# EAGLE design a915-enhancer (EAGLE 7.6.0)
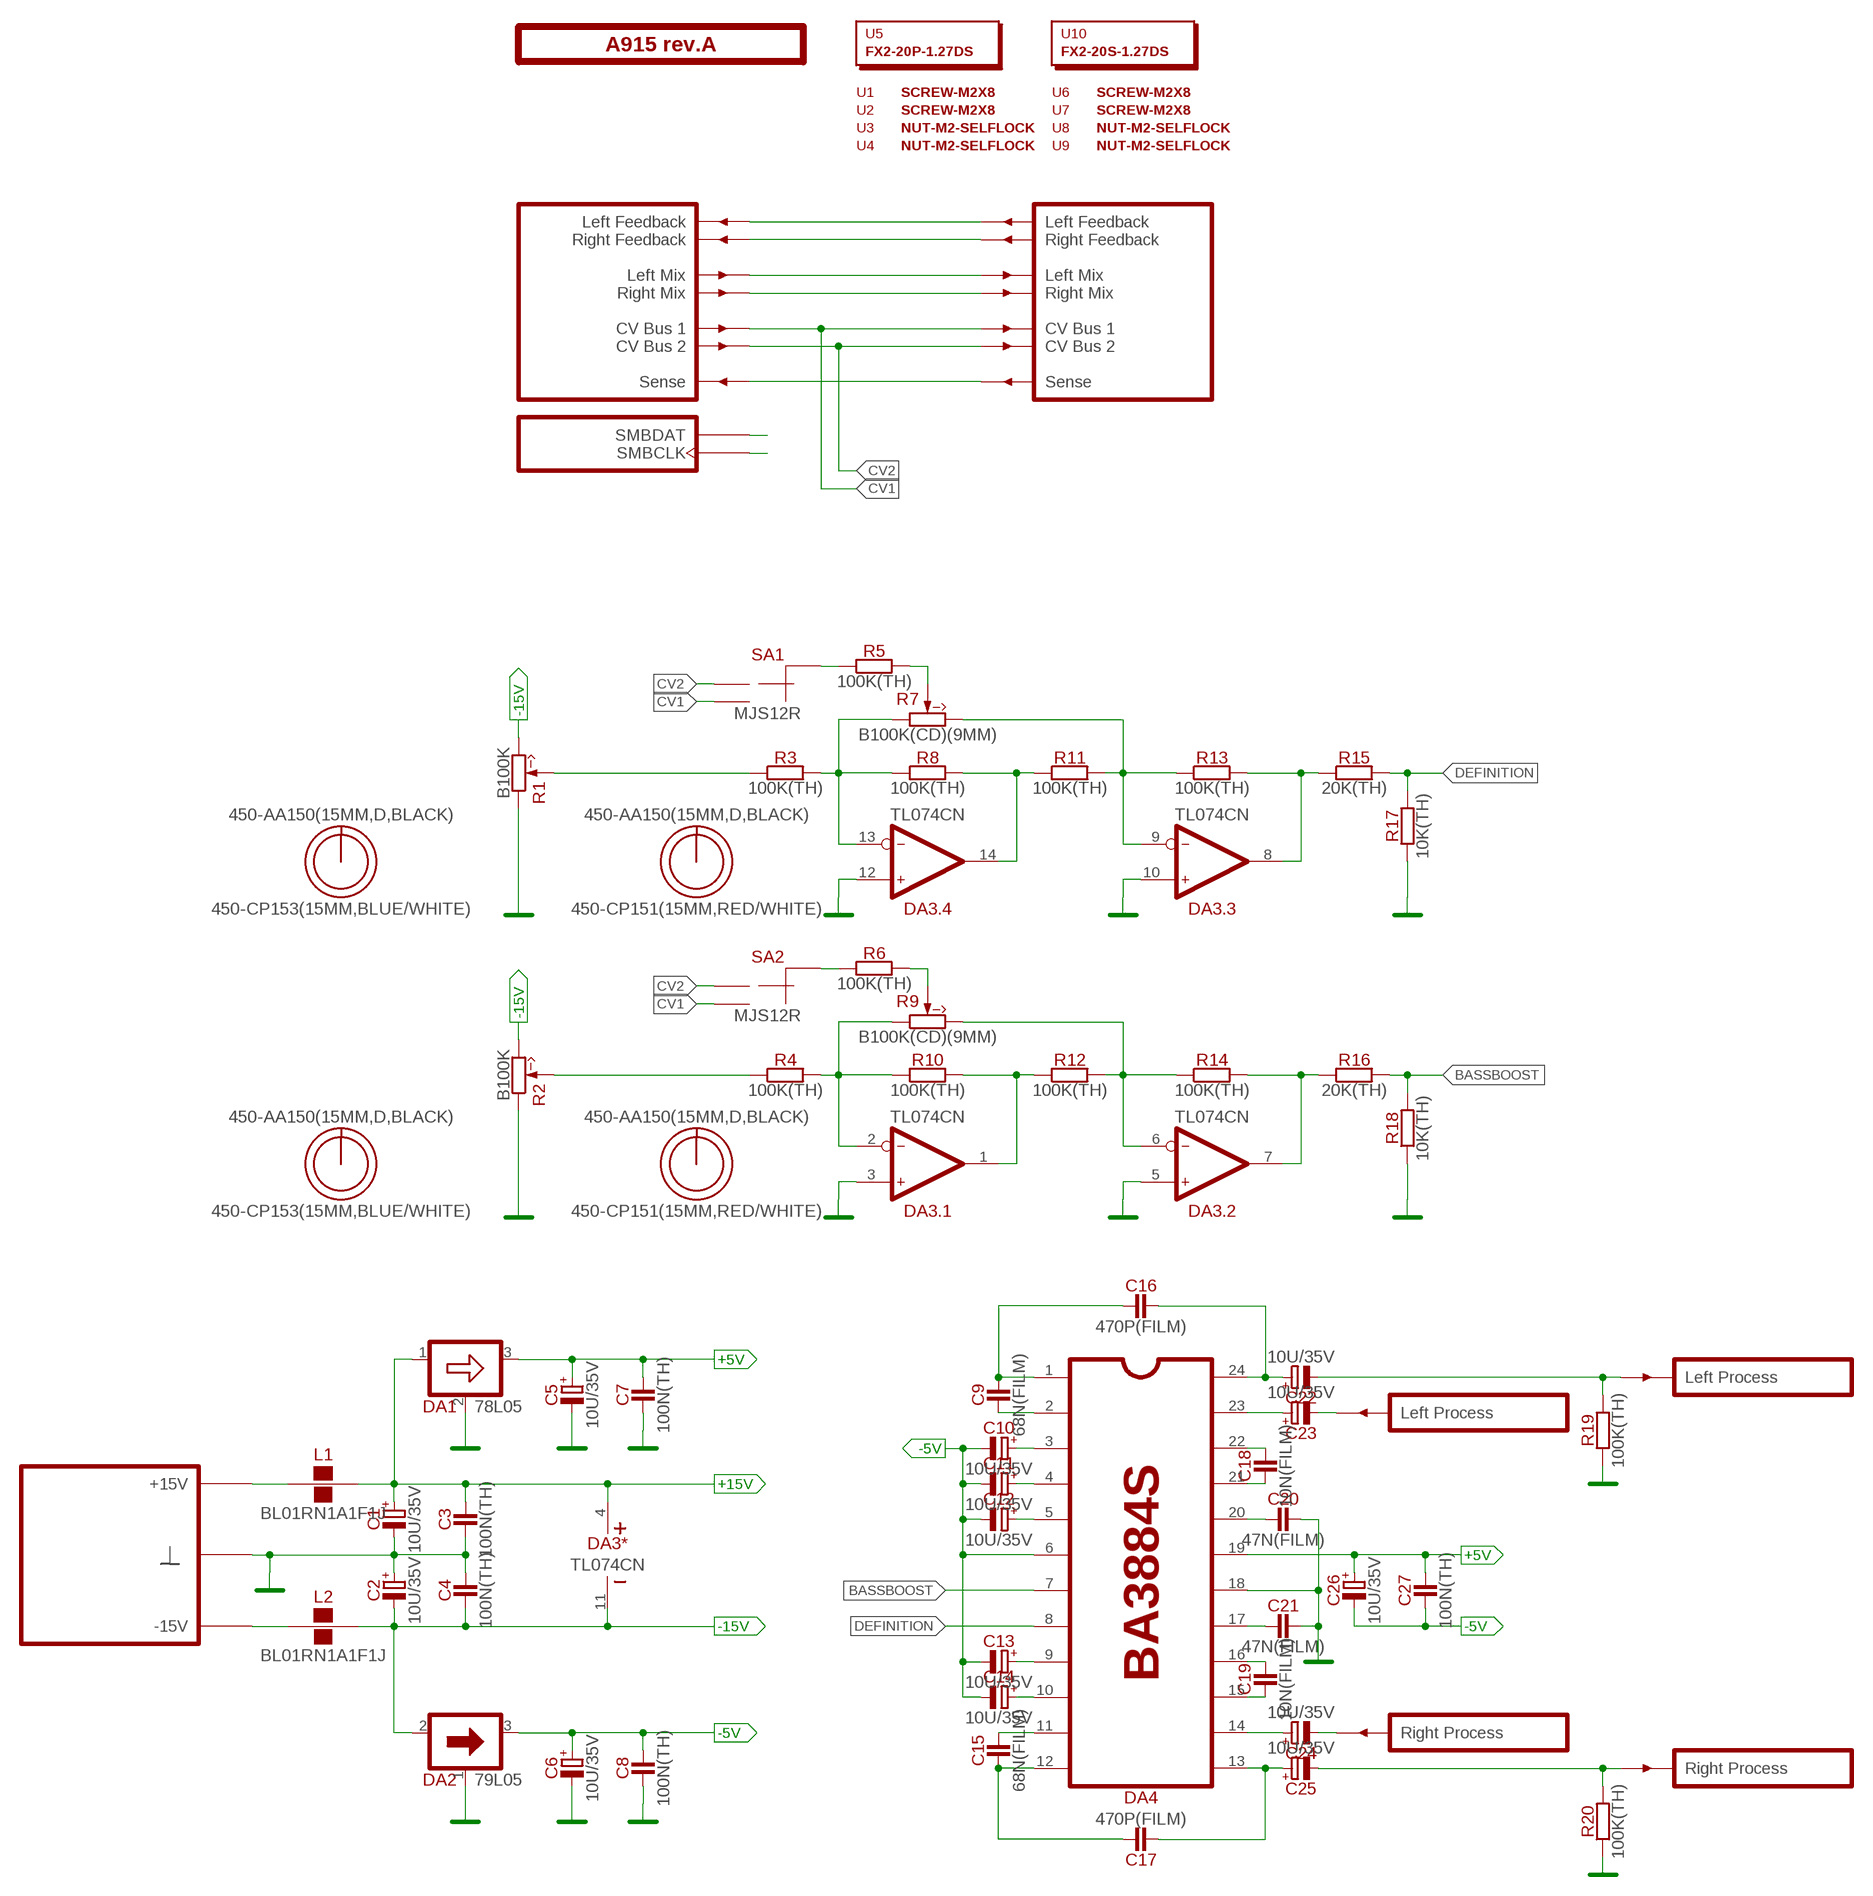
[diagram p0: schematic, sheet 1]

## Parts
C1  10U/35V  [E2-5]
C2  10U/35V  [E2-5]
C3  100N(TH)  [C050-024X044]
C4  100N(TH)  [C050-024X044]
C5  10U/35V  [E2-5]
C6  10U/35V  [E2-5]
C7  100N(TH)  [C050-024X044]
C8  100N(TH)  [C050-024X044]
C9  68N(FILM)  [C050-025X075]
C10  10U/35V  [E2-5]
C11  10U/35V  [E2-5]
C12  10U/35V  [E2-5]
C13  10U/35V  [E2-5]
C14  10U/35V  [E2-5]
C15  68N(FILM)  [C050-025X075]
C16  470P(FILM)  [C050-055X075]
C17  470P(FILM)  [C050-055X075]
C18  10N(FILM)  [C050-025X075]
C19  10N(FILM)  [C050-025X075]
C20  47N(FILM)  [C050-025X075]
C21  47N(FILM)  [C050-025X075]
C22  10U/35V  [E2-5]
C23  10U/35V  [E2-5]
C24  10U/35V  [E2-5]
C25  10U/35V  [E2-5]
C26  10U/35V  [E2-5]
C27  100N(TH)  [C050-024X044]
DA1  78L05  [TO92]
DA2  79L05  [TO92]
DA3  TL074CN  [DIP-14]
DA4  BA3884S  [SDIP-24]
L1  BL01RN1A1F1J  [BL01RN1A]
L2  BL01RN1A1F1J  [BL01RN1A]
O1  450-AA150(15MM,D,BLACK)  [EMPTY]
O2  450-CP153(15MM,BLUE/WHITE)  [EMPTY]
O3  450-AA150(15MM,D,BLACK)  [EMPTY]
O4  450-CP153(15MM,BLUE/WHITE)  [EMPTY]
O5  450-AA150(15MM,D,BLACK)  [EMPTY]
O6  450-CP151(15MM,RED/WHITE)  [EMPTY]
O7  450-AA150(15MM,D,BLACK)  [EMPTY]
O8  450-CP151(15MM,RED/WHITE)  [EMPTY]
PCB1  A915 rev.A  ST2-BOARD-50  [ST2-BOARD-50]
R1  B100K  [RV11-SINGLE]
R2  B100K  [RV11-SINGLE]
R3  100K(TH)  [R-0207/10]
R4  100K(TH)  [R-0207/10]
R5  100K(TH)  [R-0207/10]
R6  100K(TH)  [R-0207/10]
R7  B100K(CD)(9MM)  [RV09-SINGLE]
R8  100K(TH)  [R-0207/10]
R9  B100K(CD)(9MM)  [RV09-SINGLE]
R10  100K(TH)  [R-0207/10]
R11  100K(TH)  [R-0207/10]
R12  100K(TH)  [R-0207/10]
R13  100K(TH)  [R-0207/10]
R14  100K(TH)  [R-0207/10]
R15  20K(TH)  [R-0207/10]
R16  20K(TH)  [R-0207/10]
R17  10K(TH)  [R-0207/10]
R18  10K(TH)  [R-0207/10]
R19  100K(TH)  [R-0207/10]
R20  100K(TH)  [R-0207/10]
SA1  MJS12R  [APEM-MJS12R]
SA2  MJS12R  [APEM-MJS12R]
U1  SCREW-M2X8  [EMPTY]
U2  SCREW-M2X8  [EMPTY]
U3  NUT-M2-SELFLOCK  [EMPTY]
U4  NUT-M2-SELFLOCK  [EMPTY]
U5  FX2-20P-1.27DS  [EMPTY]
U6  SCREW-M2X8  [EMPTY]
U7  SCREW-M2X8  [EMPTY]
U8  NUT-M2-SELFLOCK  [EMPTY]
U9  NUT-M2-SELFLOCK  [EMPTY]
U10  FX2-20S-1.27DS  [EMPTY]

## Nets
+5V: C5.+ C7.2 C26.+ C27.2 DA1.3(OUT) DA4.19
+15V: C1.+ C3.2 DA1.1(IN) DA3.4(*:V+) L1.2
-5V: C6.+ C8.2 C10.- C11.- C12.- C13.- C14.- C26.- C27.1 DA2.3(OUT) DA4.6
-15V: C2.- C4.1 DA2.2(IN) DA3.11(*:V-) L2.2 R1.3(CW) R2.3(CW)
BASSBOOST: DA4.7 R16.2 R18.2
CV1: PCB1.ACV1'(CV1') PCB1.ACV1(CV1) SA1.NO SA2.NO
CV2: PCB1.ACV2'(CV2') PCB1.ACV2(CV2) SA1.NC SA2.NC
DEFINITION: DA4.8 R15.2 R17.2
GND: C1.- C2.+ C3.1 C4.2 C5.- C6.- C7.1 C8.1 C20.2 C21.2 DA1.2(GND) DA2.1(GND) DA3.3(.1:IN+) DA3.5(.2:IN+) DA3.10(.3:IN+) DA3.12(.4:IN+) DA4.18 PCB1.B4'(GND) PCB1.B4(GND) PCB1.B5'(GND) PCB1.B5(GND) PCB1.B6'(GND) PCB1.B6(GND) PCB1.B7'(GND) PCB1.B7(GND) PCB1.B8'(GND) PCB1.B8(GND) R1.1(CCW) R2.1(CCW) R17.1 R18.1 R19.1 R20.1
LMIX: PCB1.ALMIX'(LMIX') PCB1.ALMIX(LMIX)
N$1: L1.1 PCB1.A+15'(P+15V) PCB1.A+15(P+15V) PCB1.B+15'(P+15V) PCB1.B+15(P+15V)
N$2: PCB1.ALFBK'(LFBK') PCB1.ALFBK(LFBK)
N$3: R5.2 R7.2(W)
N$4: PCB1.ARFBK'(RFBK') PCB1.ARFBK(RFBK)
N$5: DA3.13(.4:IN-) R3.2 R7.1(CCW) R8.1
N$6: DA3.14(.4:OUT) R8.2 R11.1
N$7: DA3.9(.3:IN-) R7.3(CW) R11.2 R13.1
N$8: DA3.8(.3:OUT) R13.2 R15.1
N$9: R5.1 SA1.C(CM)
N$10: R1.2(W) R3.1
N$11: C24.+ DA4.14
N$12: C9.1 DA4.2
N$13: C9.2 C16.1 DA4.1
N$14: C15.2 DA4.11
N$15: C23.+ DA4.23
N$16: PCB1.BSENSE'(SENSE') PCB1.BSENSE(SENSE)
N$17: C15.1 C17.2 DA4.12
N$18: C14.+ DA4.10
N$19: C13.+ DA4.9
N$20: C12.+ DA4.5
N$21: C11.+ DA4.4
N$22: C10.+ DA4.3
N$23: C18.1 DA4.21
N$24: C18.2 DA4.22
N$25: L2.1 PCB1.A-15'(P-15V) PCB1.A-15(P-15V) PCB1.B-15'(P-15V) PCB1.B-15(P-15V)
N$26: C19.1 DA4.15
N$27: C19.2 DA4.16
N$28: C21.1 DA4.17
N$29: C20.1 DA4.20
N$30: R6.2 R9.2(W)
N$31: DA3.2(.1:IN-) R4.2 R9.1(CCW) R10.1
N$32: C16.2 C22.+ DA4.24
N$33: C17.1 C25.+ DA4.13
N$34: DA3.1(.1:OUT) R10.2 R12.1
N$35: DA3.6(.2:IN-) R9.3(CW) R12.2 R14.1
N$36: DA3.7(.2:OUT) R14.2 R16.1
N$37: R6.1 SA2.C(CM)
N$38: PCB1.ASMBDAT'(SMBDAT) PCB1.ASMBDAT(SMBDAT)
N$39: R2.2(W) R4.1
N$40: C23.- PCB1.BINL(INL)
N$41: C22.- PCB1.BOUTL'(OUTL) R19.2
N$42: C24.- PCB1.BINR(INR)
N$43: PCB1.ASMBCLK'(SMBCLK) PCB1.ASMBCLK(SMBCLK)
N$44: C25.- PCB1.BOUTR'(OUTR) R20.2
RMIX: PCB1.ARMIX'(RMIX') PCB1.ARMIX(RMIX)

## Library data of the parts
C1 C2 C5 C6 C10-C14 C22-C26 = capacitors-electrolytic:?; MOUSER: 647-USW1V100MDD
C3 C4 C7 C8 C27 = capacitors:?; MOUSER: 81-RCER71H104K0A2H3B
C9 C15-C17 = capacitors:?
C18 C19 = capacitors:?; MOUSER: 80-F622JF103J100C
C20 C21 = capacitors:?; MOUSER: 871-B32529C1473J
DA1 = regulators-linear:78L05
DA2 = regulators-linear:79L05
DA3 = ic-ti:TL074
DA4 = ic-rohm:BA3884
L1 L2 = inductors:BL01RN1A?; MOUSER: 81-BL01RN1A1F1J
O1 O3 O5 O7 = hardware:450-AA?; MOUSER: 450-AA150
O2 O4 = hardware:450-C?; MOUSER: 450-CP153
O6 O8 = hardware:450-C?
PCB1 = module-footprints:ST2-BOARD-?
R1 R2 = potentiometers:?
R3-R6 R8 R10-R14 R19 R20 = resistors:?; MOUSER: 71-RN55D-F-100K
R7 R9 = potentiometers:?; MOUSER: 652-PTV09A-4225FB104
R15 R16 = resistors:?
R17 R18 = resistors:?; MOUSER: 71-RN55D-F-10K
SA1 SA2 = switches:MJS12R; MOUSER: 642-MJS12R
U1-U4 U6-U9 = hardware:*?
U5 = hardware:?; MOUSER: 798-FX2-20P-1.27DS71
U10 = hardware:?; MOUSER: 798-FX2-20S-1.27DS71

## Board
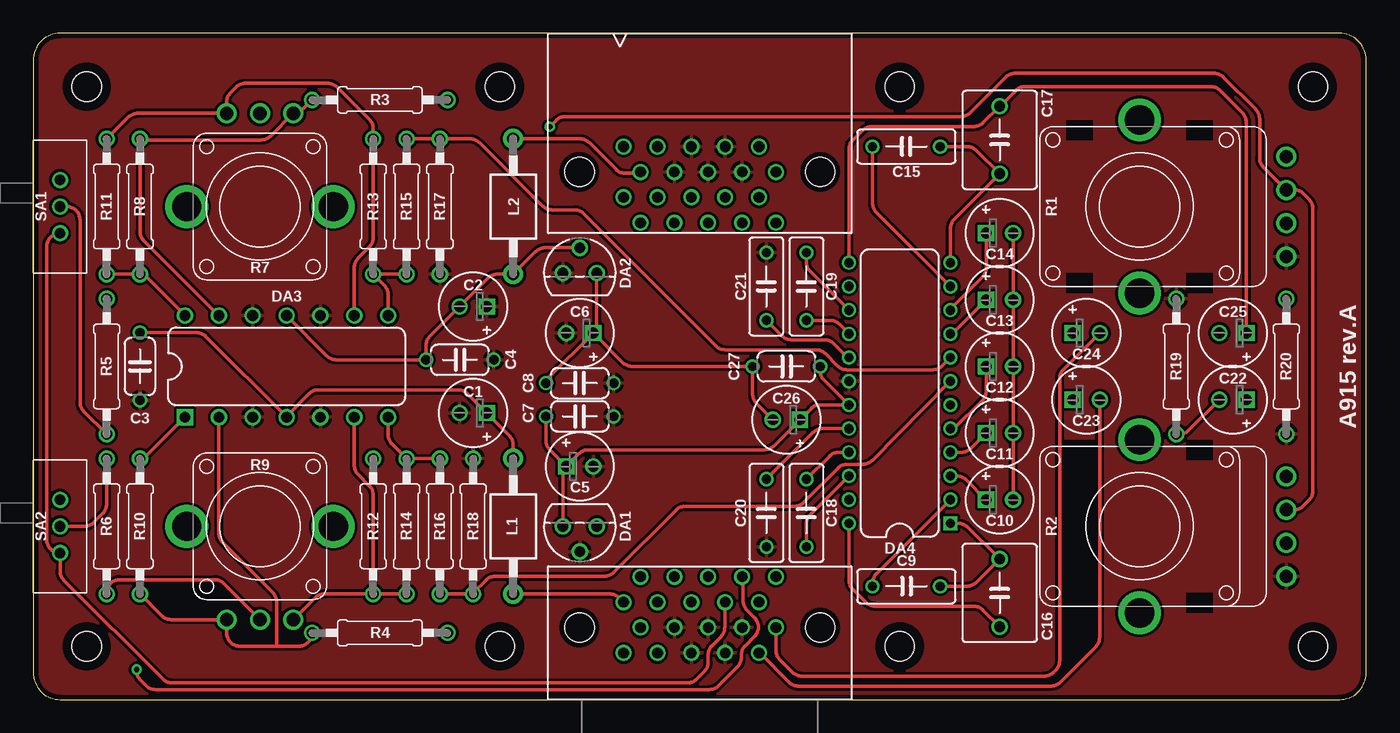
[diagram p1: board, top side]
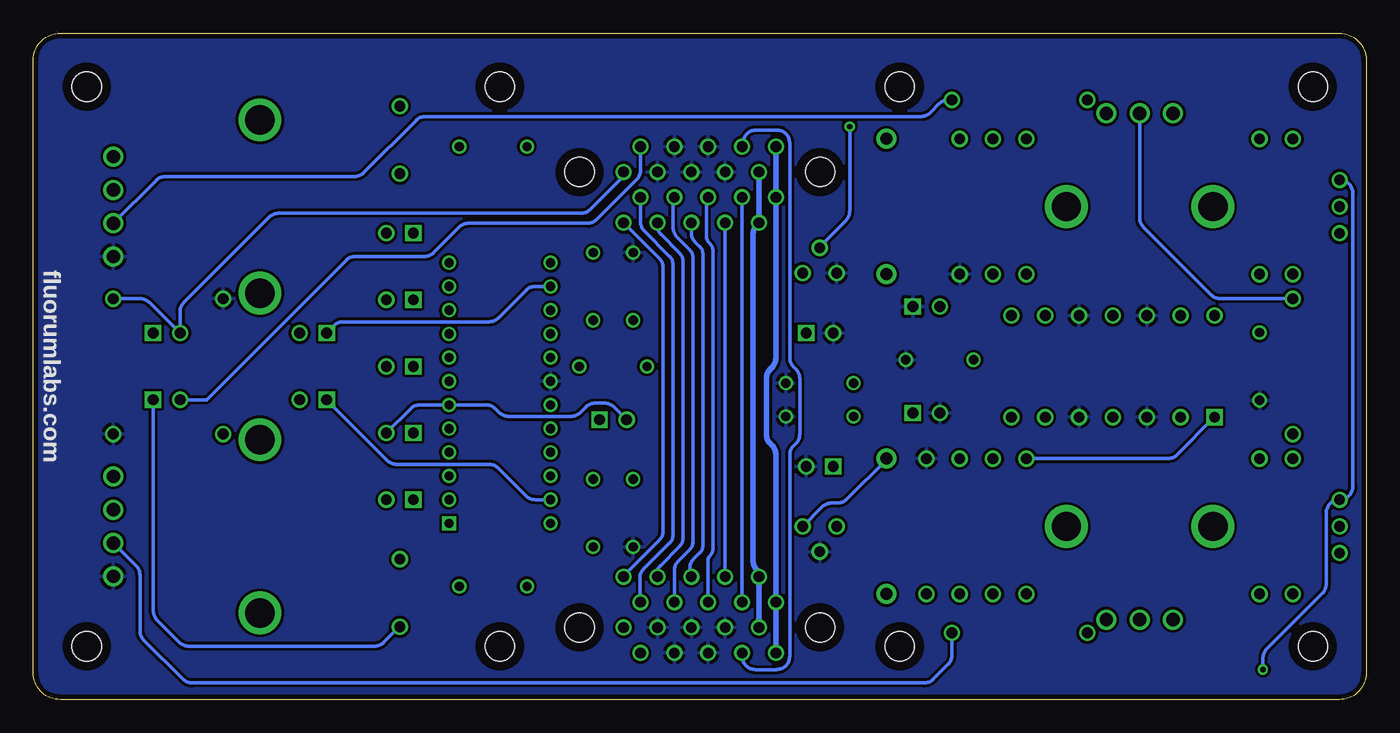
[diagram p2: board, bottom side, seen from below]

Size 100 x 50 mm. Coordinates in mm from the lower left corner, seen from the top.
Outline: 0,48 0,2 arc90 2,0 98,0 arc90 100,2 100,48 arc90 98,50 2,50 arc90 0,48
Copper layers (1*16): Top 0.0356mm / dielectric 1.5011mm / Bottom 0.0356mm
Design rules "sonictrain": minimum track width 6mil, minimum drill 13mil, track to track 8mil, track to pad 8mil, pad to pad 6mil, via to via 6mil, smd to smd 6mil, copper to edge 15mil, drill to drill 6mil, minimum pad ring 7mil, minimum via ring 7mil, stop-mask expansion 3mil, vias tented up to drill 25mil, thermal gap 10mil

### Footprints (pad centres in the part's own frame; a part is rotated, then mirrored left to right if it is on the bottom)
E2-5 = drill 0.813 square: + -1.016,0 | drill 0.813: - 1.016,0
C050-024X044 = drill 0.7: 1 -2.54,0; 2 2.54,0
C050-025X075 = drill 0.7: 1 -2.54,0; 2 2.54,0
C050-055X075 = drill 0.813: 1 -2.54,0; 2 2.54,0
TO92 = drill 0.813: 1 -1.27,0; 2 0,1.905; 3 1.27,0
DIP-14 = drill 0.813 square: 1 -7.62,-3.81 | drill 0.813: 2 -5.08,-3.81; 3 -2.54,-3.81; 4 0,-3.81; 5 2.54,-3.81; 6 5.08,-3.81; 7 7.62,-3.81; 8 7.62,3.81; 9 5.08,3.81; 10 2.54,3.81; 11 0,3.81; 12 -2.54,3.81; 13 -5.08,3.81; 14 -7.62,3.81
SDIP-24 = drill 0.7 square: 1 -9.779,-3.81 | drill 0.7: 2 -8.001,-3.81; 3 -6.223,-3.81; 4 -4.445,-3.81; 5 -2.667,-3.81; 6 -0.889,-3.81; 7 0.889,-3.81; 8 2.667,-3.81; 9 4.445,-3.81; 10 6.223,-3.81; 11 8.001,-3.81; 12 9.779,-3.81; 13 9.779,3.81; 14 8.001,3.81; 15 6.223,3.81; 16 4.445,3.81; 17 2.667,3.81; 18 0.889,3.81; 19 -0.889,3.81; 20 -2.667,3.81; 21 -4.445,3.81; 22 -6.223,3.81; 23 -8.001,3.81; 24 -9.779,3.81
BL01RN1A = drill 0.9 pad 1.5: 1 -5.08,0; 2 5.08,0
ST2-BOARD-50 = drill 0.8: A+15 44.285,7.31; A+15' 44.285,37.69; A-15 45.555,9.215; A-15' 45.555,35.785; ACV1 51.905,7.31; ACV1' 51.905,37.69; ACV2 53.175,9.215; ACV2' 53.175,35.785; ALFBK 49.365,7.31; ALFBK' 49.365,37.69; ALMIX 46.825,7.31; ALMIX' 46.825,37.69; ARFBK 50.635,9.215; ARFBK' 50.635,35.785; ARMIX 48.095,9.215; ARMIX' 48.095,35.785; ASMBCLK 55.715,9.215; ASMBCLK' 55.715,35.785; ASMBDAT 54.445,7.31; ASMBDAT' 54.445,37.69; B4 48.095,5.405; B4' 48.095,39.595; B5 49.365,3.5; B5' 49.365,41.5; B6 50.635,5.405; B6' 50.635,39.595; B7 51.905,3.5; B7' 51.905,41.5; B8 53.175,5.405; B8' 53.175,39.595; B+15 44.285,3.5; B+15' 44.285,41.5; B-15 45.555,5.405; B-15' 45.555,39.595; BINL 54.445,3.5; BINR 55.715,5.405; BOUTL' 54.445,41.5; BOUTR' 55.715,39.595; BSENSE 46.825,3.5; BSENSE' 46.825,41.5 | hole 2.2: 4,4; 4,46; 96,4; 96,46; 35,46; 65,46; 65,4; 35,4; 59.025,5.405; 40.975,5.405; 40.975,39.595; 59.025,39.595
RV11-SINGLE = drill 1: 1 -3.75,-11; 2 -1.25,-11; 3 1.25,-11; 4 3.75,-11 | drill 2.2: S1 -6.5,0; S2 6.5,0
R-0207/10 = drill 0.813: 1 -5.08,0; 2 5.08,0
RV09-SINGLE = drill 1: 1 -2.5,-7; 2 0,-7; 3 2.5,-7 | drill 2.2: S1 -5.5,0; S2 5.5,0
APEM-MJS12R = drill 0.8: C 0,-2; NC 2,-2; NO -2,-2

### Placement (x,y rotation side)
C1  33,21.5 180 top
C2  33,29.5 180 top
C3  8,25 90 top
C4  32,25.5 0 top
C5  41,17.5 0 top
C6  41,27.5 180 top
C7  41,21.25 180 top
C8  41,23.75 180 top
C9  65.5,8.5 0 top
C10  72.5,15 0 top
C11  72.5,20 0 top
C12  72.5,25 0 top
C13  72.5,30 0 top
C14  72.5,35 0 top
C15  65.5,41.5 180 top
C16  72.5,8 270 top
C17  72.5,42 270 top
C18  58,14 270 top
C19  58,31 270 top
C20  55,14 270 top
C21  55,31 90 top
C22  90,22.5 180 top
C23  79,22.5 0 top
C24  79,27.5 0 top
C25  90,27.5 180 top
C26  56.5,21 180 top
C27  56.5,25 0 top
DA1  41,13 180 top
DA2  41,32 0 top
DA3  19,25 0 top
DA4  65,23 90 top
L1  36,13 90 top
L2  36,37 270 top
O1  93,-106 0 top  (outside the outline)
O2  96,-106 0 top  (outside the outline)
O3  99,-106 0 top  (outside the outline)
O4  2,-109 0 top  (outside the outline)
O5  5,-109 0 top  (outside the outline)
O6  8,-109 0 top  (outside the outline)
O7  11,-109 0 top  (outside the outline)
O8  14,-109 0 top  (outside the outline)
PCB1  0,0 0 top
R1  83,37 90 top
R2  83,13 90 top
R3  26,45 180 top
R4  26,5 180 top
R5  5.5,25 90 top
R6  5.5,13 270 top
R7  17,37 180 top
R8  8,37 270 top
R9  17,13 0 top
R10  8,13 90 top
R11  5.5,37 90 top
R12  25.5,13 270 top
R13  25.5,37 270 top
R14  28,13 90 top
R15  28,37 90 top
R16  30.5,13 270 top
R17  30.5,37 90 top
R18  33,13 270 top
R19  85.75,25 270 top
R20  94,25 90 top
SA1  0,37 90 top
SA2  0,13 90 top
U1  17,-109 0 top  (outside the outline)
U2  20,-109 0 top  (outside the outline)
U3  23,-109 0 top  (outside the outline)
U4  26,-109 0 top  (outside the outline)
U5  29,-109 0 top  (outside the outline)
U6  32,-109 0 top  (outside the outline)
U7  35,-109 0 top  (outside the outline)
U8  38,-109 0 top  (outside the outline)
U9  41,-109 0 top  (outside the outline)
U10  44,-109 0 top  (outside the outline)

### Tracks (layer width: path | path; a pad name or v marks a point on that pad's centre or on a via)
+5V
  Top 0.254: DA1.3 39.73,16.89 arc-45 C5.+ | C7.2 38.46,19.44 arc45 38.75,18.73 C5.+ | C27.2 59.04,24.68 arc45 59.33,23.97 DA4.19 59.04,22.11 arc45 58.33,21.82 C26.+ 55.56,19.04 arc-45 54.85,18.75 41.66,18.75 arc45 40.96,18.46 40,17.5 C5.+
+15V
  Top 0.254: L1.2 36,19.1 arc45 35.71,19.81 C1.+ 32.56,22.96 arc45 31.85,23.25 21.41,23.25 arc45 20.71,22.96 19,21.25 DA3.4 12.94,27.25 arc45 12.24,27.54 C3.2
  Bottom 0.254: L1.2 36,18 38.96,15.04 arc45 39.66,14.75 40.11,14.75 arc-45 40.81,14.46 DA1.1
-5V
  Top 0.254: DA2.3 42.27,28.11 arc-45 C6.+ | C8.2 arc-45 38.6,24.08 C6.+ | C10.- C11.- C12.- C13.- C14.- | C26.- 54.25,22.23 arc-45 53.96,22.94 C27.1 44.93,25 arc-45 44.22,25.29 C6.+
  Bottom 0.254: C11.- 71.7,21.82 arc45 70.99,22.11 DA4.6 66.03,22.11 arc45 65.32,21.82 65.04,21.54 arc-45 64.34,21.25 59.66,21.25 arc-45 58.96,21.54 58.54,21.96 arc45 57.84,22.25 57.15,22.25 arc45 56.44,21.96 C26.-
-15V  (via drill 0.4)
  Top 0.254: DA3.11 22.02,25.79 arc45 22.72,25.5 C4.1 29.46,26.56 arc-45 29.75,27.27 C2.- 34.11,31.63 arc-45 34.82,31.92 L2.2 37.69,33.61 arc-45 38.4,33.91 DA2.2 | R2.3 94.59,14.25 arc45 95.29,14.54 95.71,14.96 arc45 96,15.66 96,36.84 arc45 95.71,37.54 95.29,37.96 arc45 94.59,38.25 R1.3 92.29,39.96 arc-45 92,40.66 92,43.59 arc45 91.71,44.29 89.29,46.71 arc45 88.59,47 73.66,47 arc45 72.96,46.71 70.29,44.04 arc-45 69.59,43.75 39.91,43.75 arc45 39.21,43.46 v38.75,43
  Bottom 0.254: DA2.2 41,34 39.04,35.96 arc-45 38.75,36.66 v38.75,43
BASSBOOST
  Top 0.254: R16.2 R18.2 33,8 33.96,8.96 arc-45 34.66,9.25 42.84,9.25 arc45 43.54,9.54 48.21,14.21 arc-45 48.91,14.5 57.09,14.5 arc45 57.79,14.79 60.36,17.36 arc-45 61.06,17.65 62.23,17.65 arc45 62.94,17.95 DA4.7
CV1
  Top 0.254: SA1.NO arc90 1,34 1,12 arc90 SA2.NO 2,9.66 arc45 2.29,8.96 9.71,1.54 arc45 10.41,1.25 49.09,1.25 arc45 49.79,1.54 50.33,2.08 arc45 50.62,2.79 50.62,3.34 arc-45 50.92,4.04 51.58,4.71 arc45 51.88,5.41 51.88,7.28 PCB1.ACV1
  Bottom 0.254: PCB1.ACV1 51.91,9.68 arc45 51.61,10.39 50.79,11.21 arc-45 50.5,11.91 50.5,33.09 arc-45 50.79,33.79 51.71,34.71 arc45 52,35.41 52,37.59 PCB1.ACV1'
CV2  (via drill 0.4)
  Top 0.254: v7.75,2.25 7.75,2.16 arc45 8.04,1.46 8.46,1.04 arc45 9.16,0.75 50.71,0.75 arc45 51.42,1.04 52.83,2.46 arc45 53.12,3.16 53.12,3.34 arc-45 53.42,4.04 54.1,4.73 arc90 54.1,6.14 53.54,6.71 arc-45 53.25,7.41 53.25,9.14 PCB1.ACV2
  Bottom 0.254: PCB1.ACV2' 53.17,35.59 arc-45 52.88,34.88 51.54,33.54 arc45 51.25,32.84 51.25,12.16 arc45 51.54,11.46 52.96,10.04 arc-45 53.25,9.34 53.25,9.29 PCB1.ACV2 | SA1.NC arc90 1,38 1,16 arc90 SA2.NC arc-90 3,14 3,8.66 arc45 3.29,7.96 7.46,3.79 arc-45 7.75,3.09 v7.75,2.25
DEFINITION
  Top 0.254: R15.2 R17.2 32.76,42.08 arc-45 33.46,41.79 38.21,37.04 arc45 38.91,36.75 40.59,36.75 arc-45 41.29,36.46 51.21,26.54 arc45 51.91,26.25 58.71,26.25 arc-45 59.42,25.96 60.33,25.04 arc45 61.04,24.75 67.48,24.75 arc45 68.19,25.04 DA4.8
GND
  pour Top: 0,50 100,50 100,0 0,0
  pour Bottom: 0,50 100,50 100,0 0,0
LMIX
  Bottom 0.254: PCB1.ALMIX PCB1.ALMIX'
N$1
  Top 0.254: L1.1 43.26,7.92 arc-45 43.97,7.63 PCB1.A+15
  Bottom 0.406: PCB1.B+15' PCB1.A+15' 44.28,25.63 arc45 44.58,24.92 44.71,24.79 arc-45 45,24.09 45,19.91 arc-45 44.71,19.21 44.58,19.08 arc45 44.28,18.37 PCB1.A+15 PCB1.B+15
N$2
  Bottom 0.254: PCB1.ALFBK 49.37,10.53 arc45 49.29,10.71 arc-45 49,11.41 49,33.59 arc-45 49.29,34.29 arc45 49.5,34.79 49.5,37.55 PCB1.ALFBK'
N$3
  Bottom 0.254: R5.2 10.92,30.08 arc45 11.62,30.37 16.71,35.46 arc45 17,36.16 R7.2
N$4
  Bottom 0.254: PCB1.ARFBK' 50.63,35.05 arc-45 50.34,34.34 50.04,34.04 arc45 49.75,33.34 49.75,11.66 arc45 50.04,10.96 50.46,10.54 arc-45 50.75,9.84 50.75,9.33 PCB1.ARFBK
N$5
  Top 0.254: R3.2 20.21,44.29 arc-45 R7.1 17.79,42.29 arc-45 17.09,42 8.08,42 R8.1 8,35.14 arc45 8.29,34.44 DA3.13
N$6
  Top 0.254: R11.1 R8.2 arc-45 8.46,31.73 DA3.14
N$7
  Top 0.254: R11.2 7.13,43.71 arc-45 7.83,44 R7.3 14.5,44.84 arc-45 14.79,45.54 15.21,45.96 arc-45 15.91,46.25 22.09,46.25 arc-45 22.79,45.96 25.21,43.54 arc-45 25.5,42.84 R13.1 25.5,34.66 arc-45 25.21,33.96 24.37,33.12 arc45 24.08,32.42 DA3.9
N$8
  Top 0.254: DA3.8 26.62,30.39 arc45 26.33,31.09 R13.2 R15.1
N$9
  Top 0.254: SA1.C 2.5,37 arc-90 3.5,36 3.5,22.33 arc45 3.79,21.63 R5.1
N$10
  Bottom 0.254: R3.1 31.34,45 arc-45 32.04,44.71 32.71,44.04 arc45 33.41,43.75 70.59,43.75 arc-45 71.29,43.46 75.21,39.54 arc45 75.91,39.25 90.09,39.25 arc-45 90.79,38.96 R1.2
N$11
  Bottom 0.254: DA4.14 62.34,31 arc-45 63.04,30.71 65.11,28.64 arc45 65.81,28.35 76.73,28.35 arc-46 77.44,28.05 C24.+
N$12
  Top 0.254: C9.1 62.96,8.73 arc-45 63.25,9.44 DA4.2
N$13
  Top 0.254: DA4.1 69.41,13.22 arc-45 70.11,12.93 C16.1 70.75,8.79 arc-45 70.05,8.5 C9.2
N$14
  Top 0.254: C15.2 62.96,37.27 arc45 63.25,36.56 DA4.11
N$15
  Bottom 0.254: DA4.23 62.34,15 arc45 63.04,15.29 65.11,17.36 arc-45 65.81,17.65 72.73,17.65 arc45 73.44,17.94 C23.+
N$16
  Bottom 0.254: PCB1.BSENSE 46.83,3.25 arc-90 45.83,2.25 44.25,2.25 arc-90 43.25,3.25 43.25,18.34 arc45 42.96,19.04 42.79,19.21 arc-45 42.5,19.91 42.5,24.09 arc-45 42.79,24.79 42.96,24.96 arc45 43.25,25.66 43.25,41.75 arc-90 44.25,42.75 45.75,42.75 arc-90 46.75,41.75 46.75,41.58 PCB1.BSENSE'
N$17
  Top 0.254: DA4.12 68.81,35.36 arc-45 69.1,36.06 C17.2 70.75,41.21 arc45 70.05,41.5 C15.1
N$18
  Top 0.254: DA4.10 68.81,29.31 71.21,31.71 arc45 71.5,32.41 71.5,34.98 C14.+
N$19
  Top 0.254: DA4.9 68.93,27.45 C13.+
N$20
  Top 0.254: DA4.5 69.08,20.33 71.21,22.46 arc45 71.5,23.16 71.5,24.98 C12.+
N$21
  Top 0.254: DA4.4 69.62,18.55 arc45 70.33,18.85 C11.+
N$22
  Top 0.254: DA4.3 69.29,16.78 arc-45 70,16.48 C10.+
N$23
  Top 0.254: DA4.21 60.43,18.55 arc45 59.72,18.26 C18.1
N$24
  Top 0.254: C18.2 58,13.17 arc-45 58.29,13.88 DA4.22
N$25
  Top 0.254: L2.1 41.01,42.08 arc-45 41.71,41.79 43.71,39.79 arc45 44.41,39.5 45.46,39.5 PCB1.B-15'
  Bottom 0.406: PCB1.B-15' PCB1.A-15' 45.71,35.63 arc-45 46,34.93 46,10.41 arc-45 45.71,9.71 45.55,9.55 PCB1.A-15 PCB1.B-15
N$26
  Top 0.254: C19.1 58,32.83 arc45 58.29,32.12 DA4.15
N$27
  Top 0.254: C19.2 59.76,28.46 arc-45 60.47,28.17 DA4.16
N$28
  Top 0.254: DA4.17 61.08,25.67 60.04,26.71 arc45 59.34,27 56.87,27 arc-45 56.17,27.29 C21.1
N$29
  Top 0.254: DA4.20 59.21,20.33 arc45 58.5,20.04 C20.1
N$30
  Top 0.254: R6.2 5.5,8 arc-90 6.5,9 13.59,9 arc-45 14.29,8.71 R9.2
N$31
  Top 0.254: R4.2 arc-90 19.92,4 18.25,4 | 18.25,4 15.5,4 arc-90 14.5,5 R9.1 10.33,6 arc-45 9.63,6.29 R10.1 | DA3.2 13.92,12.49 arc45 14.21,11.79 17.96,8.04 arc-45 18.25,7.34 18.25,4
N$32
  Top 0.254: DA4.24 61.19,8.97 arc45 61.48,8.27 62.46,7.29 arc45 63.16,7 70.55,7 arc-45 71.25,6.71 C16.2
  Bottom 0.254: C16.2 72.54,5.46 73.71,4.29 arc45 74.41,4 88.34,4 arc45 89.04,4.29 90.71,5.96 arc45 91,6.66 91,22.48 C22.+
N$33
  Top 0.254: DA4.13 61.19,41.28 arc-45 61.48,41.98 62.21,42.71 arc-45 62.91,43 70.55,43 arc45 71.25,43.29 C17.1 72.54,44.54 73.71,45.71 arc-45 74.41,46 88.34,46 arc-45 89.04,45.71 90.71,44.04 arc-45 91,43.34 91,27.52 C25.+
N$34
  Top 0.254: R10.2 8.27,18.08 DA3.1
  Bottom 0.254: R12.1 14.9,18.08 arc-45 14.2,18.37 DA3.1
N$35
  Top 0.254: R14.1 R12.2 | R12.2 21.83,7.92 arc45 21.13,7.63 R9.3 | DA3.6 24.08,17.58 arc45 24.37,16.88 25.21,16.04 arc-45 25.5,15.34 R12.2
N$36
  Top 0.254: DA3.7 26.62,19.87 arc45 26.91,19.17 R14.2 R16.1
N$37
  Top 0.254: SA2.C 3.84,13 arc45 4.54,13.29 5.21,13.96 arc45 5.5,14.66 R6.1
N$38
  Bottom 0.254: PCB1.ASMBDAT' 54.45,35.86 arc-45 54.15,35.15 52.29,33.29 arc45 52,32.59 52,12.41 arc45 52.29,11.71 54.21,9.79 arc-45 54.5,9.09 54.5,7.37 PCB1.ASMBDAT
N$39
  Bottom 0.254: R4.1 31.08,3.33 arc45 31.37,2.63 32.46,1.54 arc45 33.16,1.25 88.09,1.25 arc45 88.79,1.54 91.71,4.46 arc45 92,5.16 92,9.34 arc-45 92.29,10.04 R2.2
N$40
  Top 0.254: PCB1.BINL 54.5,3.5 56.71,1.29 arc45 57.41,1 76.34,1 arc45 77.04,1.29 79.71,3.96 arc45 80,4.66 80,22.48 C23.-
N$41
  Top 0.254: R19.2 85.99,19.92 arc45 86.7,20.21 C22.-
  Bottom 0.254: PCB1.BOUTL' 54.45,39.72 arc45 54.74,39.01 57.71,36.04 arc45 58.41,35.75 67.34,35.75 arc-45 68.04,35.46 69.96,33.54 arc45 70.66,33.25 75.84,33.25 arc-45 76.54,32.96 87,22.5 C22.-
N$42
  Top 0.254: PCB1.BINR 55.72,3.7 arc45 56.01,2.99 56.96,2.04 arc45 57.66,1.75 75.84,1.75 arc45 76.54,2.04 76.71,2.21 arc45 77,2.91 77,24.07 arc-45 77.29,24.78 C24.-
N$43
  Bottom 0.254: PCB1.ASMBCLK 55.78,9.21 53.04,11.96 arc-45 52.75,12.66 52.75,32.41 arc-45 53.04,33.11 PCB1.ASMBCLK'
N$44
  Bottom 0.254: R20.2 91.98,30.08 arc45 91.27,29.79 C25.- 89,27.52 89,29.09 arc45 88.71,29.79 82.29,36.21 arc45 81.59,36.5 58.91,36.5 arc-45 58.21,36.79 55.93,39.07 arc-45 PCB1.BOUTR'
RMIX
  Bottom 0.254: PCB1.ARMIX' PCB1.ARMIX